# Altium schematic sheet usb.SCHDOC: USB and FPGA Boot System
size A4; Organization: Berne University of Applied Science; Address1: School of Engineering and; Address2: Information Technology; Address3: Quellgasse 21; Address4: CH-2501 Biel; Revision: 1.0; SheetNumber: 14; SheetTotal: 19; ApprovedBy: zem1; Author: zac1
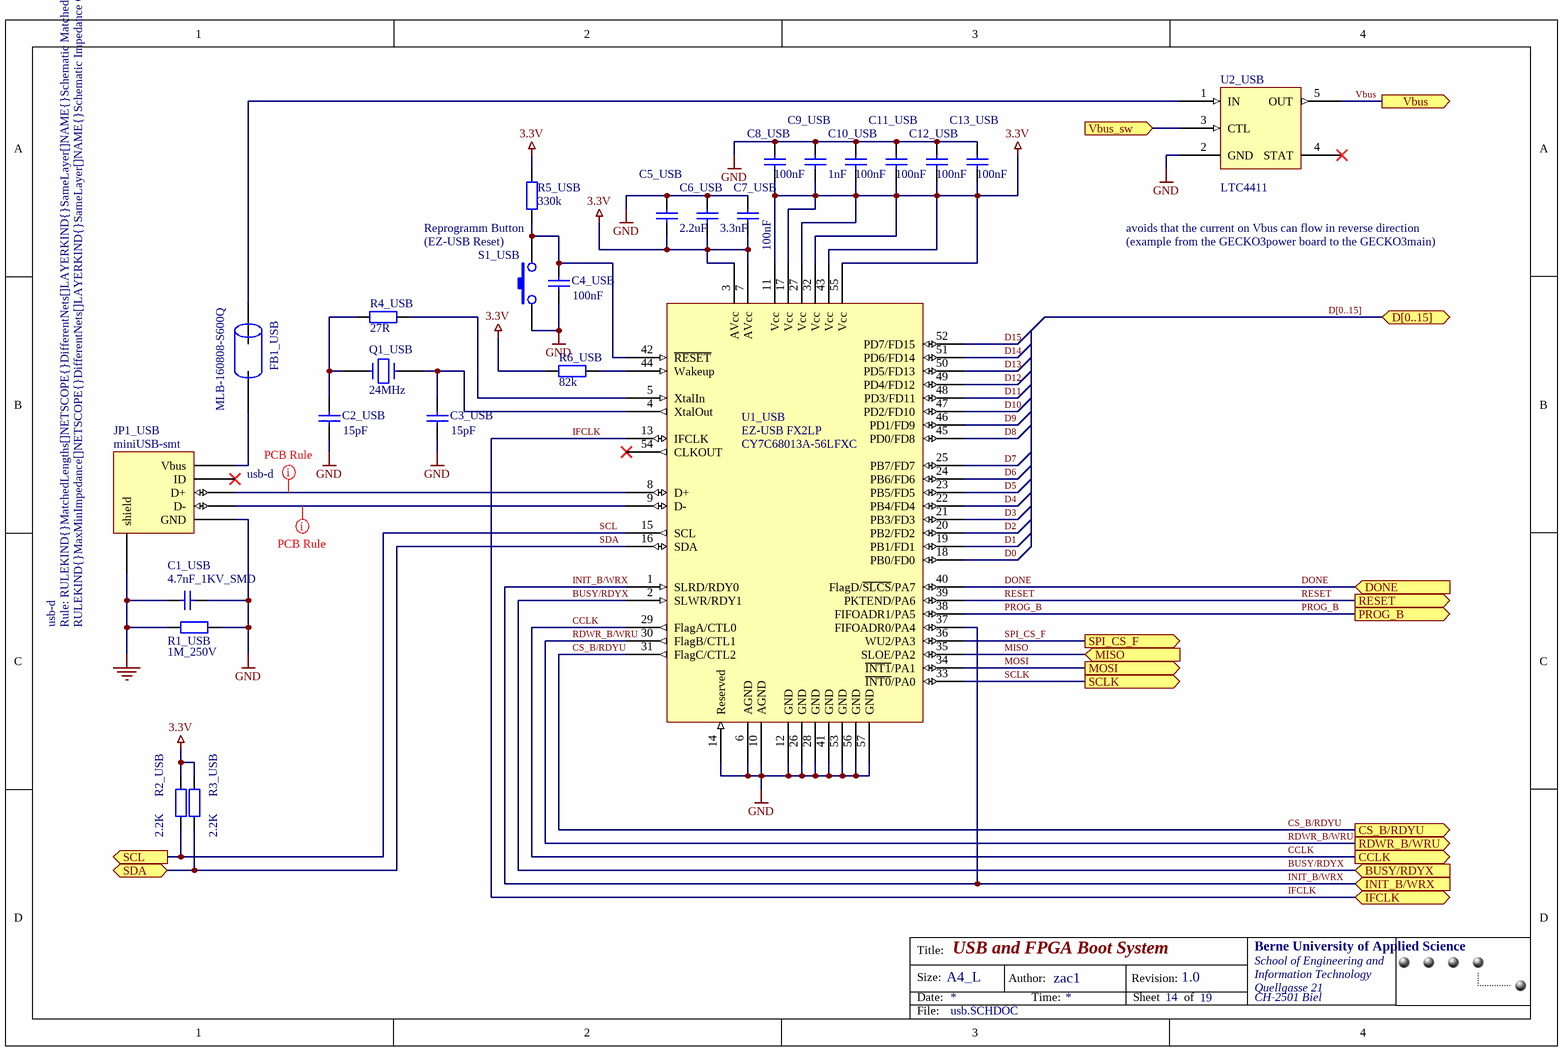
[diagram p0: usb.SCHDOC]

## Parts
C1_USB  value 4.7nF_1KV_SMD  [CC3216-1206]  (hidden comment: C)
C2_USB  value 15pF  [0402]  (hidden comment: C0402)
C3_USB  value 15pF  [0402]  (hidden comment: C0402)
C4_USB  value 100nF  [0402]  (hidden comment: C0402)
C5_USB  value 2.2uF  [0805]  (hidden comment: Cap)
C6_USB  value 3.3nF  [0402]  (hidden comment: Cap)
C7_USB  value 100nF  [0402]  (hidden comment: Cap)
C8_USB  value 100nF  [0402]  (hidden comment: Cap)
C9_USB  value 1nF  [0402]  (hidden comment: Cap)
C10_USB  value 100nF  [0402]  (hidden comment: Cap)
C11_USB  value 100nF  [0402]  (hidden comment: Cap)
C12_USB  value 100nF  [0402]  (hidden comment: Cap)
C13_USB  value 100nF  [0402]  (hidden comment: Cap)
FB1_USB  value MLB-160808-S600Q  [0603]  (hidden comment: FERRITE-BEAD)
JP1_USB  value miniUSB-smt  [USB_MINI_B_SMD]  (hidden comment: USB-MINIB-SMT)
Q1_USB  value 24MHz  [AT49]  (hidden comment: QUARZ-SMD)
R1_USB  value 1M_250V  [CC3216-1206]  (hidden comment: Res2)
R2_USB  value 2.2K  [0402]  (hidden comment: Res2)
R3_USB  value 2.2K  [0402]  (hidden comment: Res2)
R4_USB  value 27R  [0402]  (hidden comment: Res2)
R5_USB  value 330k  [0402]  (hidden comment: Res2)
R6_USB  value 82k  [0402]  (hidden comment: Res2)
S1_USB  Reprogramm Button  [FSM]
U1_USB  EZ-USB FX2LP  value CY7C68013A-56LFXC  [QFN8x8]
U2_USB  LTC4411  [TSOP-23-5]

## Ports
BUSY/RDYX (in), CCLK (out), CS_B/RDYU (out), D[0..15] (bidir), DONE (in), IFCLK (bidir), INIT_B/WRX (in), MISO (in), MOSI (out), PROG_B (out), RDWR_B/WRU (out), RESET (out), SCL (out), SCLK (out), SDA (bidir), SPI_CS_F (out), Vbus (out), Vbus_sw (in)

## Nets
3.3V: C5_USB.1 C6_USB.1 C7_USB.1 C8_USB.1 C9_USB.1 C10_USB.1 C11_USB.1 C12_USB.1 C13_USB.1 R2_USB.2 R3_USB.2 R5_USB.2 R6_USB.2 U1_USB.3(AVcc) U1_USB.7(AVcc) U1_USB.11(Vcc) U1_USB.17(Vcc) U1_USB.27(Vcc) U1_USB.32(Vcc) U1_USB.43(Vcc) U1_USB.55(Vcc)
Earth: C1_USB.1 JP1_USB.shield R1_USB.1
GND: C1_USB.2 C2_USB.1 C3_USB.1 C4_USB.1 C5_USB.2 C6_USB.2 C7_USB.2 C8_USB.2 C9_USB.2 C10_USB.2 C11_USB.2 C12_USB.2 C13_USB.2 JP1_USB.GND R1_USB.2 S1_USB.1 U1_USB.6(AGND) U1_USB.10(AGND) U1_USB.12(GND) U1_USB.14(Reserved) U1_USB.26(GND) U1_USB.28(GND) U1_USB.41(GND) U1_USB.53(GND) U1_USB.56(GND) U1_USB.57(GND) U2_USB.2(GND)
BUSY/RDYX: U1_USB.2(SLWR/RDY1) ; port BUSY/RDYX
CCLK: U1_USB.29(FlagA/CTL0) ; port CCLK
CS_B/RDYU: U1_USB.31(FlagC/CTL2) ; port CS_B/RDYU
D0: U1_USB.18(PB0/FD0)
D1: U1_USB.19(PB1/FD1)
D2: U1_USB.20(PB2/FD2)
D3: U1_USB.21(PB3/FD3)
D4: U1_USB.22(PB4/FD4)
D5: U1_USB.23(PB5/FD5)
D6: U1_USB.24(PB6/FD6)
D7: U1_USB.25(PB7/FD7)
D8: U1_USB.45(PD0/FD8)
D9: U1_USB.46(PD1/FD9)
D10: U1_USB.47(PD2/FD10)
D11: U1_USB.48(PD3/FD11)
D12: U1_USB.49(PD4/FD12)
D13: U1_USB.50(PD5/FD13)
D14: U1_USB.51(PD6/FD14)
D15: U1_USB.52(PD7/FD15)
DONE: U1_USB.40(FlagD/~{SLCS}/PA7) ; port DONE
IFCLK: U1_USB.13(IFCLK) ; port IFCLK
INIT_B/WRX: U1_USB.1(SLRD/RDY0) U1_USB.37(FIFOADR0/PA4) ; port INIT_B/WRX
MISO: U1_USB.35(SLOE/PA2) ; port MISO
MOSI: U1_USB.34(~{INT1}/PA1) ; port MOSI
PROG_B: U1_USB.38(FIFOADR1/PA5) ; port PROG_B
RDWR_B/WRU: U1_USB.30(FlagB/CTL1) ; port RDWR_B/WRU
RESET: U1_USB.39(PKTEND/PA6) ; port RESET
SCL: R2_USB.1 U1_USB.15(SCL) ; port SCL
SCLK: U1_USB.33(~{INT0}/PA0) ; port SCLK
SDA: R3_USB.1 U1_USB.16(SDA) ; port SDA
SPI_CS_F: U1_USB.36(WU2/PA3) ; port SPI_CS_F
Vbus: U2_USB.5(OUT) ; port Vbus
Vbus_sw: U2_USB.3(CTL) ; port Vbus_sw
NetC2_USB_2: C2_USB.2 Q1_USB.1 R4_USB.2
NetC3_USB_2: C3_USB.2 Q1_USB.2 U1_USB.4(XtalOut)
NetC4_USB_2: C4_USB.2 R5_USB.1 S1_USB.2 U1_USB.42(~{RESET})
NetFB1_USB_1: FB1_USB.1 JP1_USB.Vbus
NetFB1_USB_2: FB1_USB.2 U2_USB.1(IN)
NetJP1_USB_D+: JP1_USB.D+ U1_USB.8(D+)
NetJP1_USB_D-: JP1_USB.D- U1_USB.9(D-)
NetR4_USB_1: R4_USB.1 U1_USB.5(XtalIn)
NetR6_USB_1: R6_USB.1 U1_USB.44(Wakeup)

Not connected (* = marked no-connect by the designer): JP1_USB ID*; U1_USB 54(CLKOUT)*; U2_USB 4(STAT)*

## Buses and harness runs
bus D[0..15] = port D[0..15]

## Layout directives
rule Matched Net Lengths [Tolerance = 1mm    Style - 90 Degrees    Amplitude = 5.08mm    Gap = 0.508mm    ]; net class usb-d; rule Impedance Constraint [Min = 79.00    Max = 100.0    ]: NetJP1_USB_D-
net class usb-d: NetJP1_USB_D+

## Notes on the sheet
- (EZ-USB Reset)
- avoids that the current on Vbus can flow in reverse direction
- (example from the GECKO3power board to the GECKO3main)
- Title:
- Size:
- Date:
- A4_L
- Author:
- Time:
- Revision:
- Sheet
- of
- File:

## Library data of the parts
C1_USB = C: Manufacturer: AVX; Part Number: 1206AC472KAT1A; Currency: CHF; Packaging unit: 5; Prize: 0.38; Distributor Number: 1216 464; RoHS: yes; Distributor: Farnell
C2_USB C3_USB = C0402: Ceramic Chip Capacitor - Standard; Manufacturer: AVX; Part Number: 04025A150JAT2A; Note: Footprint corresponds to dimensions for bulk cassette packaging. This case size has tightened tolerances.; Currency: CHF; Packaging unit: 1; Prize: 0.07; Published: 17-Jul-2002; LatestRevisionNote: Silkscreen size reduced.; PackageDocument: Mar-2001; PackageReference: 0402; Publisher: Altium Limited; Code_JEITA: 0402; Code_IPC: 1005 [0402]; Distributor Number: 1327 631; RoHS: yes; Distributor: Farnell
C4_USB = C0402: Ceramic Chip Capacitor - Standard; Manufacturer: Murata; Part Number: GRM155R71C104KA88D; Note: Footprint corresponds to dimensions for bulk cassette packaging. This case size has tightened tolerances.; Currency: CHF; Packaging unit: 10; Prize: 0.07; Published: 17-Jul-2002; LatestRevisionNote: Silkscreen size reduced.; PackageDocument: Mar-2001; PackageReference: 0402; Publisher: Altium Limited; Code_JEITA: 0402; Code_IPC: 1005 [0402]; Distributor Number: 8819 742; RoHS: yes; Distributor: Farnell
C5_USB = Cap: Capacitor; Manufacturer: Murata; Part Number: GRM21BR71A225KA01L; Class I: Passive; Currency: CHF; Packaging unit: 1; Prize: 0.54; Published: 8-Jun-2000; Revision: July-2002: Re-released for DXP Platform.; Publisher: Altium Limited; Class II: Capacitor; Distributor Number: 823 517; RoHS: yes; Distributor: Distrelec
C6_USB = Cap: Capacitor; Manufacturer: PHYCOMP; Part Number: 2238 587 15629; Class I: Passive; Currency: CHF; Packaging unit: 10; Prize: 0.11; Published: 8-Jun-2000; Revision: July-2002: Re-released for DXP Platform.; Publisher: Altium Limited; Class II: Capacitor; Distributor Number: 3019 410; RoHS: yes; Distributor: Farnell
C7_USB C8_USB C10_USB C11_USB C12_USB C13_USB = Cap: Capacitor; Manufacturer: Murata; Part Number: GRM155R71C104KA88D; Class I: Passive; Currency: CHF; Packaging unit: 10; Prize: 0.07; Published: 8-Jun-2000; Revision: July-2002: Re-released for DXP Platform.; Publisher: Altium Limited; Class II: Capacitor; Distributor Number: 8819 742; RoHS: yes; Distributor: Farnell
C9_USB = Cap: Capacitor; Manufacturer: PHYCOMP; Part Number: 2238 587 15623; Class I: Passive; Currency: CHF; Packaging unit: 10; Prize: 0.11; Published: 8-Jun-2000; Revision: July-2002: Re-released for DXP Platform.; Publisher: Altium Limited; Class II: Capacitor; Distributor Number: 3019 380; RoHS: yes; Distributor: Farnell
FB1_USB = FERRITE-BEAD: Manufacturer: Kitagawa; Currency: CHF; Packaging unit: 5; Prize: 0.75; Distributor Number: 330131; Part Number: MLB-160808-S600Q; RoHS: yes; Distributor: Distrelec
JP1_USB = USB-MINIB-SMT: Manufacturer: Lumberg; Part Number: 2486 01; Currency: CHF; Packaging unit: 1; Prize: 2.55; Distributor Number: 1243 250; RoHS: yes; Distributor: Farnell
Q1_USB = QUARZ-SMD: SMD Quarz in the AT49 Case, like the ABLS series from Abracon; Manufacturer: auris; Part Number: Q-24.000M-HC49USSMD-F-30-50-D-30; Currency: CHF; Packaging unit: 1; Prize: 1.29; Distributor Number: 335040; RoHS: yes; Distributor: Distrelec
R1_USB = Res2: Resistor; Manufacturer: Multicomp; Part Number: MC 0.125W 1206 1% 1M; Class I: Passive; Currency: CHF; Packaging unit: 50; Prize: 0.055; Published: 8-Jun-2000; Revision: July-2002: Re-released for DXP Platform.; Publisher: Altium Limited; Class II: Resistor; Distributor Number: 9335781; RoHS: X-yes; Distributor: Farnell
R2_USB R3_USB = Res2: Resistor; Manufacturer: PHYCOMP; Part Number: 232270672202; Class I: Passive; Currency: CHF; Packaging unit: 50; Prize: 0.12; Published: 8-Jun-2000; Revision: July-2002: Re-released for DXP Platform.; Publisher: Altium Limited; Class II: Resistor; Distributor Number: 9239278; RoHS: yes; Distributor: Farnell
R4_USB = Res2: Resistor; Manufacturer: PHYCOMP; Part Number: 232270672709; Class I: Passive; Currency: CHF; Packaging unit: 50; Prize: 0.12; Published: 8-Jun-2000; Revision: July-2002: Re-released for DXP Platform.; Publisher: Altium Limited; Class II: Resistor; Distributor Number: 9239049; RoHS: yes; Distributor: Farnell
R5_USB = Res2: Resistor; Manufacturer: PHYCOMP; Part Number: 232270673304; Class I: Passive; Currency: CHF; Packaging unit: 50; Prize: 0.12; Published: 8-Jun-2000; Revision: July-2002: Re-released for DXP Platform.; Publisher: Altium Limited; Class II: Resistor; Distributor Number: 9239537; RoHS: yes; Distributor: Farnell
R6_USB = Res2: Resistor; Manufacturer: PHYCOMP; Part Number: 232270678203; Class I: Passive; Currency: CHF; Packaging unit: 50; Prize: 0.12; Published: 8-Jun-2000; Revision: July-2002: Re-released for DXP Platform.; Publisher: Altium Limited; Class II: Resistor; Distributor Number: 9239464; RoHS: yes; Distributor: Farnell
S1_USB = SW_PB: Manufacturer: TYCO; Part Number: 0-1437565-1; Value: FSM; Currency: CHF; Packaging unit: 1; Prize: 0.86; Distributor Number: 200858; RoHS: yes; Distributor: Distrelec
U1_USB = EZ-USB-FX2_QFN: Manufacturer: Cypress; Currency: CHF; lead time: 5 Weeks; Packaging unit: 260; Prize: 12.39; Distributor Number: CY7C68013A56LFXC; Part Number: CY7C68013A-56LFXC; RoHS: yes; Distributor: Silica
U2_USB = LTC4411: Manufacturer: Linear; Part Number: LTC4411ES5#PBF; Currency: $; Packaging unit: 1; Prize: 2.36; lead time: 2 Weeks; Value: LTC4411; Distributor Number: LTC4411ES5#PBF; RoHS: yes; Distributor: Linear online